# EAGLE design samd51breakout (EAGLE 7.7.0)
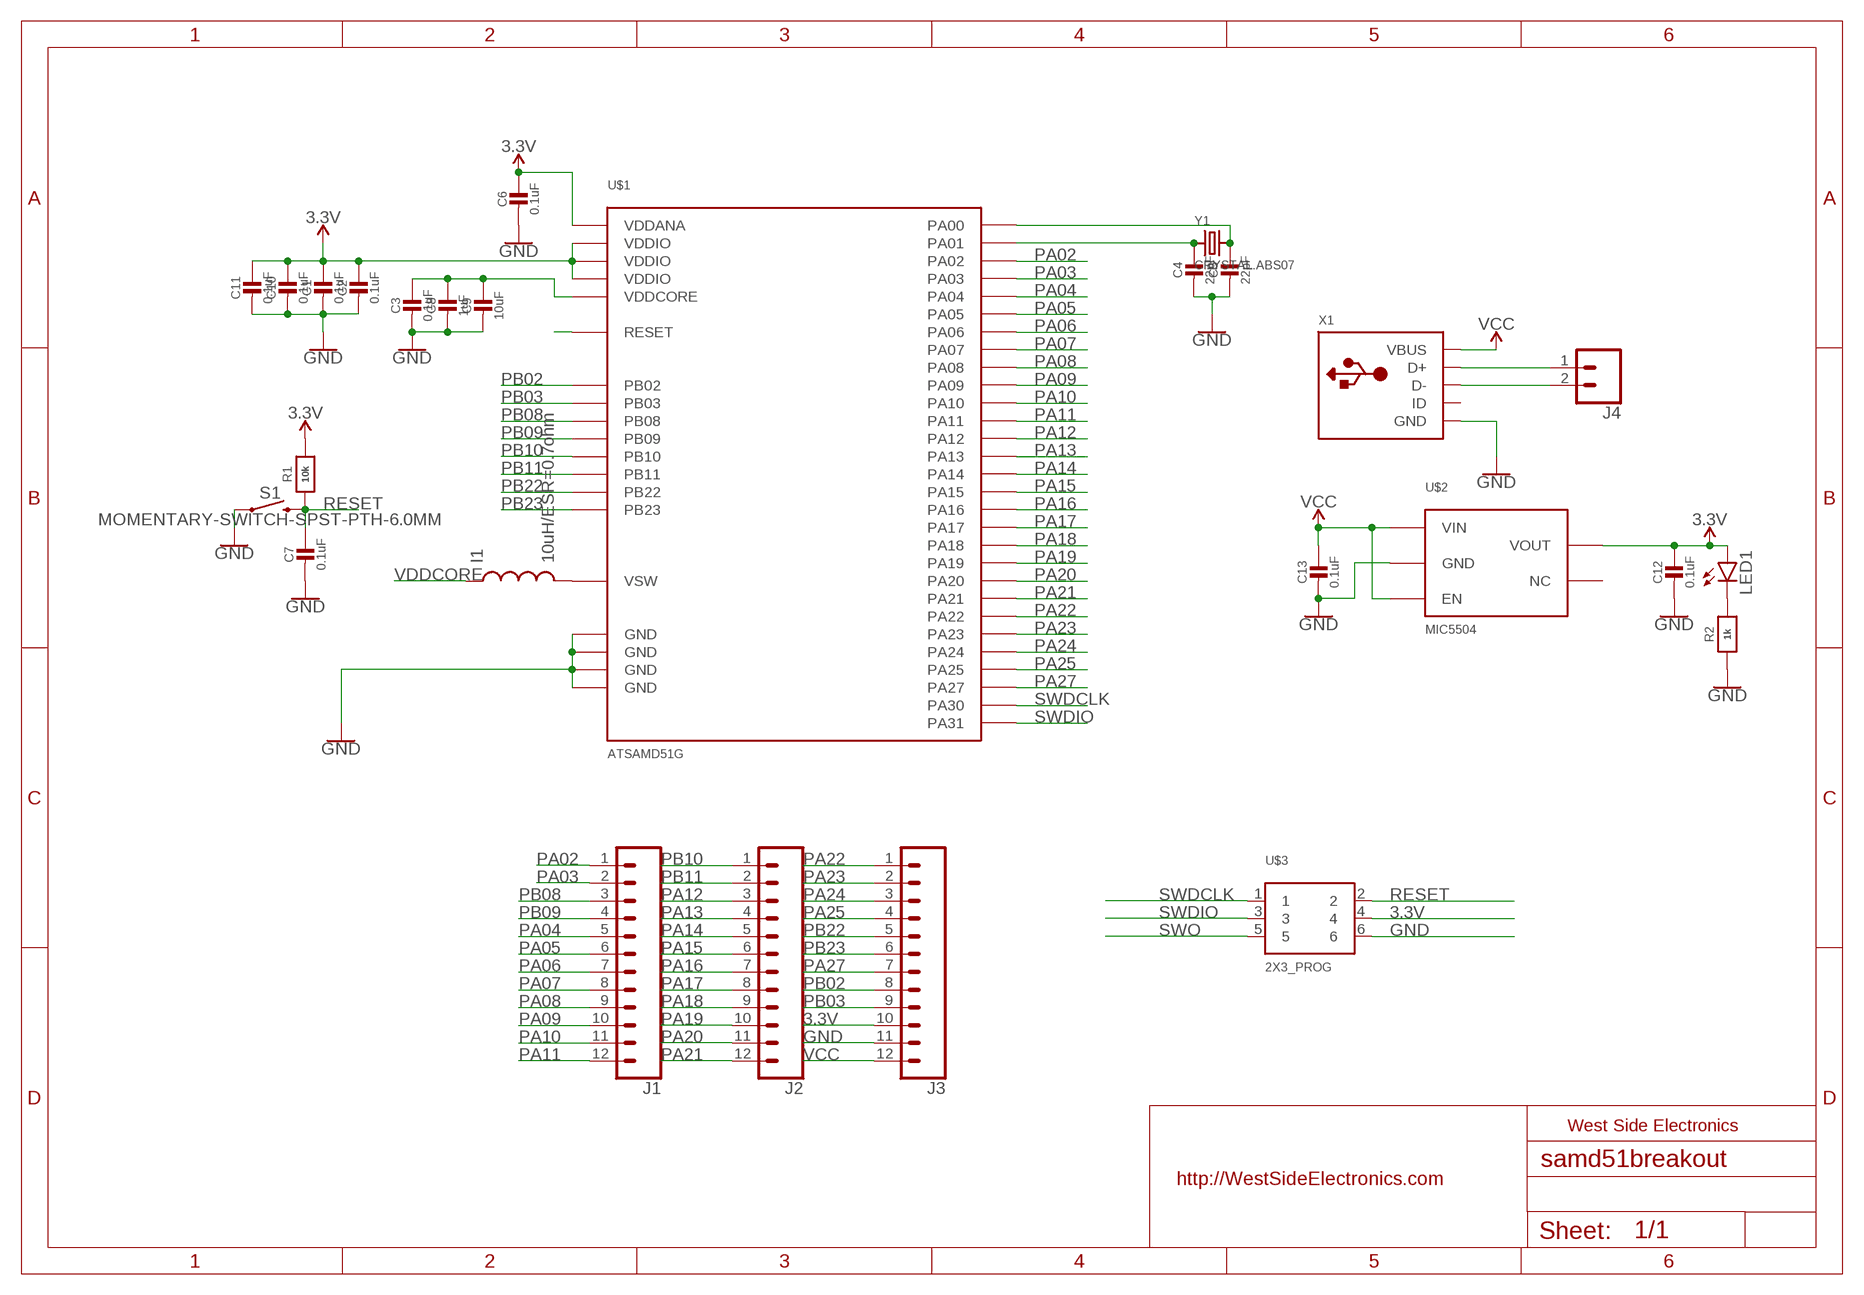
[diagram p0: schematic, sheet 1]

## Parts
C1  0.1uF  CAP_CERAMIC_0603MP  [_0603MP]
C2  0.1uF  CAP_CERAMIC_0603MP  [_0603MP]
C3  0.1uF  CAP_CERAMIC_0603MP  [_0603MP]
C4  22pF  CAP_CERAMIC_0603MP  [_0603MP]
C5  22pF  CAP_CERAMIC_0603MP  [_0603MP]
C6  0.1uF  CAP_CERAMIC_0603MP  [_0603MP]
C7  0.1uF  CAP_CERAMIC_0603MP  [_0603MP]
C8  1uF  CAP_CERAMIC_0603MP  [_0603MP]
C9  10uF  CAP_CERAMIC_0603MP  [_0603MP]
C10  0.1uF  CAP_CERAMIC_0603MP  [_0603MP]
C11  0.1uF  CAP_CERAMIC_0603MP  [_0603MP]
C12  0.1uF  CAP_CERAMIC_0603MP  [_0603MP]
C13  0.1uF  CAP_CERAMIC_0603MP  [_0603MP]
I1  10uH/ESR=0.7ohm  IND  [0805]
J1  CONN_12  [1X12]
J2  CONN_12  [1X12]
J3  CONN_12  [1X12]
J4  CONN_02  [1X02]
LED1  LED0603  [LED-0603]
R1  10k  RESISTOR_0603MP  [_0603MP]
R2  1k  RESISTOR_0603MP  [_0603MP]
S1  MOMENTARY-SWITCH-SPST-PTH-6.0MM  [TACTILE_SWITCH_PTH_6.0MM]
U$1  ATSAMD51G  [QFN-48]
U$2  MIC5504  [SOT23-5]
U$3  2X3_PROG  [2X3-SMD_PROG]
X1  MICROBUILDER_USB_MICRO_20329_V2  [MICROBUILDER_4UCONN_20329_V2]
Y1  CRYSTAL.ABS07  [ABS07]

## Nets
3.3V: C1.1 C2.1 C6.1 C10.1 C11.1 C12.1 J3.10 LED1.A R1.2 U$1.6(VDDANA) U$1.17(VDDIO) U$1.36(VDDIO) U$1.44(VDDIO) U$2.5(VOUT) U$3.4
GND: C1.2 C2.2 C3.2 C4.2 C5.2 C6.2 C7.2 C8.2 C9.2 C10.2 C11.2 C12.2 C13.2 J3.11 R2.1 S1.1 U$1.5(GND) U$1.18(GND) U$1.35(GND) U$1.42(GND) U$2.2(GND) U$3.6 X1.BASE@1(GND) X1.BASE@2(GND) X1.GND X1.SPRT@1(GND) X1.SPRT@2(GND) X1.SPRT@3(GND) X1.SPRT@4(GND)
N$1: I1.2 U$1.43(VSW)
N$2: LED1.C R2.2
N$4: C4.1 U$1.2(PA01) Y1.1
N$5: C5.1 U$1.1(PA00) Y1.2
N$7: J4.1 X1.D+
N$8: J4.2 X1.D-
PA02: J1.1 U$1.3(PA02)
PA03: J1.2 U$1.4(PA03)
PA04: J1.5 U$1.9(PA04)
PA05: J1.6 U$1.10(PA05)
PA06: J1.7 U$1.11(PA06)
PA07: J1.8 U$1.12(PA07)
PA08: J1.9 U$1.13(PA08)
PA09: J1.10 U$1.14(PA09)
PA10: J1.11 U$1.15(PA10)
PA11: J1.12 U$1.16(PA11)
PA12: J2.3 U$1.21(PA12)
PA13: J2.4 U$1.22(PA13)
PA14: J2.5 U$1.23(PA14)
PA15: J2.6 U$1.24(PA15)
PA16: J2.7 U$1.25(PA16)
PA17: J2.8 U$1.26(PA17)
PA18: J2.9 U$1.27(PA18)
PA19: J2.10 U$1.28(PA19)
PA20: J2.11 U$1.29(PA20)
PA21: J2.12 U$1.30(PA21)
PA22: J3.1 U$1.31(PA22)
PA23: J3.2 U$1.32(PA23)
PA24: J3.3 U$1.33(PA24)
PA25: J3.4 U$1.34(PA25)
PA27: J3.7 U$1.39(PA27)
PB02: J3.8 U$1.47(PB02)
PB03: J3.9 U$1.48(PB03)
PB08: J1.3 U$1.7(PB08)
PB09: J1.4 U$1.8(PB09)
PB10: J2.1 U$1.19(PB10)
PB11: J2.2 U$1.20(PB11)
PB22: J3.5 U$1.37(PB22)
PB23: J3.6 U$1.38(PB23)
RESET: C7.1 R1.1 S1.3 U$1.40(RESET) U$3.2
SWDCLK: U$1.45(PA30) U$3.1
SWDIO: U$1.46(PA31) U$3.3
SWO: U$3.5
VCC: C13.1 J3.12 U$2.1(VIN) U$2.3(EN) X1.VBUS
VDDCORE: C3.1 C8.1 C9.1 I1.1 U$1.41(VDDCORE)
Unconnected: U$2.4(NC) X1.ID

## Library data of the parts
C1-C13 = microbuilder:CAP_CERAMIC: Ceramic Capacitors For new designs, use the packages preceded by an '_' character since they are more reliable: The following footprints should be used on most boards: _0402 - Standard footprint for regular board layouts _0603 - Standard footprint for regular board layouts _0805 - Standard footprint for regular board layouts _1206 - Standard footprint for regular board layouts For extremely tight-pitch boards where space is at a premium, the following 'micro-pitch' footprints can be used (smaller pads, no silkscreen outline, etc.): _0402MP - Micro-pitch footprint for very dense/compact boards _0603MP - Micro-pitch footprint for very dense/compact boards _0805MP - Micro-pitch footprint for very dense/compact boards _1206MP - Micro-pitch footprint for very dense/compact boards
I1 = Ilya_Teach:IND
J1-J3 = SparkFun-Connectors:CONN_12: Multi connection point. Often used as Generic Header-pin footprint for 0.1 inch spaced/style header connections On any of the 0.1 inch spaced packages, you can populate with these: Break Away Headers - Straight <https://www.sparkfun.com/products/116> (PRT-00116) Break Away Male Headers - Right Angle <https://www.sparkfun.com/products/553> (PRT-00553) Female Headers <https://www.sparkfun.com/products/115> (PRT-00115) Break Away Headers - Machine Pin <https://www.sparkfun.com/products/117> (PRT-00117) Break Away Female Headers - Swiss Machine Pin <https://www.sparkfun.com/products/743> (PRT-00743) For SCREWTERMINALS and SPRING TERMINALS visit here: Screw Terimnals on SparkFun.com <https://www.sparkfun.com/search/results?term=Screw+Terminals> (5mm/3.5mm/2.54mm spacing) This device is also useful as a general connection point to wire up your design to another part of your project. Our various solder wires solder well into these plated through hole pads. Hook-Up Wire - Assortment (Stranded, 22 AWG) <https://www.sparkfun.com/products/11375> (PRT-11375) Hook-Up Wire - Assortment (Solid Core, 22 AWG) <https://www.sparkfun.com/products/11367> (PRT-11367) View the entire wire category on our website here <https://www.sparkfun.com/categories/141> Special notes: Molex polarized connector foot print use with SKU : PRT-08231 with associated crimp pins and housings. 1MM SMD Version SKU: PRT-10208 NOTES ON THE VARIANTS LOCK and LOCK_LONGPADS... This footprint was designed to help hold the alignment of a through-hole component (i.e. 6-pin header) while soldering it into place. You may notice that each hole has been shifted either up or down by 0.005 of an inch from it's more standard position (which is a perfectly straight line). This slight alteration caused the pins (the squares in the middle) to touch the edges of the holes. Because they are alternating, it causes a "brace" to hold the component in place. 0.005 has proven to be the perfect amount of "off-center" position when using our standard breakaway headers. Although looks a little odd when you look at the bare footprint, once you have a header in there, the alteration is very hard to notice. Also,if you push a header all the way into place, it is covered up entirely on the bottom side.
J4 = SparkFun-Connectors:CONN_02: Multi connection point. Often used as Generic Header-pin footprint for 0.1 inch spaced/style header connections On any of the 0.1 inch spaced packages, you can populate with these: Break Away Headers - Straight <https://www.sparkfun.com/products/116> (PRT-00116) Break Away Male Headers - Right Angle <https://www.sparkfun.com/products/553> (PRT-00553) Female Headers <https://www.sparkfun.com/products/115> (PRT-00115) Break Away Headers - Machine Pin <https://www.sparkfun.com/products/117> (PRT-00117) Break Away Female Headers - Swiss Machine Pin <https://www.sparkfun.com/products/743> (PRT-00743) For SCREWTERMINALS and SPRING TERMINALS visit here: Screw Terimnals on SparkFun.com <https://www.sparkfun.com/search/results?term=Screw+Terminals> (5mm/3.5mm/2.54mm spacing) This device is also useful as a general connection point to wire up your design to another part of your project. Our various solder wires solder well into these plated through hole pads. Hook-Up Wire - Assortment (Stranded, 22 AWG) <https://www.sparkfun.com/products/11375> (PRT-11375) Hook-Up Wire - Assortment (Solid Core, 22 AWG) <https://www.sparkfun.com/products/11367> (PRT-11367) View the entire wire category on our website here <https://www.sparkfun.com/categories/141> Special notes: Molex polarized connector foot print use with: PRT-08233 with associated crimp pins and housings. 2.54_SCREWTERM for use with PRT-10571. 3.5mm Screw Terminal footprints for PRT-08084 5mm Screw Terminal footprints for use with PRT-08432
LED1 = genLib:LED: LEDs Standard schematic elements and footprints for 5mm, 3mm, 1206, and 0603 sized LEDs. 5mm - Spark Fun Electronics SKU : COM-00529 (and others)
R1 R2 = microbuilder:RESISTOR: Resistors For new designs, use the packages preceded by an '_' character since they are more reliable: The following footprints should be used on most boards: _0402 - Standard footprint for regular board layouts _0603 - Standard footprint for regular board layouts _0805 - Standard footprint for regular board layouts _1206 - Standard footprint for regular board layouts For extremely tight-pitch boards where space is at a premium, the following 'micro-pitch' footprints can be used (smaller pads, no silkscreen outline, etc.): _0402MP - Micro-pitch footprint for very dense/compact boards _0603MP - Micro-pitch footprint for very dense/compact boards _0805MP - Micro-pitch footprint for very dense/compact boards _1206MP - Micro-pitch footprint for very dense/compact boards
S1 = SparkFun-Switches:MOMENTARY-SWITCH-SPST: Momentary Switch (Pushbutton) - SPST Normally-open (NO) SPST momentary switches (buttons, pushbuttons). Variants PTH-12MM - 12mm square, through-hole Momentary Pushbutton Switch - 12mm Square <https://www.sparkfun.com/products/9190> (COM-09190) PTH-6.0MM, PTH-6.0MM-KIT - 6.0mm square, through-hole Mini Pushbutton Switch <https://www.sparkfun.com/products/97> (COM-00097) KIT package intended for soldering kit's - only one side of pads' copper is exposed. PTH-RIGHT-ANGLE-KIT - Right-angle, through-hole Right Angle Tactile Button <https://www.sparkfun.com/products/10791> - Used on SparkFun BigTime Watch Kit <https://www.sparkfun.com/products/11734> SMD-12MM - 12mm square, surface-mount Tactile Button - SMD (12mm) <https://www.sparkfun.com/products/12993> (COM-12993) Used on SparkFun PicoBoard <https://www.sparkfun.com/products/11888> SMD-4.5MM - 4.5mm Square Trackball Switch Used on SparkFun Blackberry Trackballer Breakout <https://www.sparkfun.com/products/13169> SMD-4.6MMX2.8MM - 4.60mm x 2.80mm, surface mount Used on SparkFun SAMD21 Mini Breakout <https://www.sparkfun.com/products/13664> SMD-5.2MM, SMD-5.2-REDUNDANT - 5.2mm square, surface-mount Mini Pushbutton Switch - SMD <https://www.sparkfun.com/products/8720> (COM-08720) Used on Arduino Pro Mini <https://www.sparkfun.com/products/11114> REDUNDANT package connects both switch circuits together SMD-6.0X3.5MM - 6.0 x 3.5mm, surface mount Momentary Reset Switch SMD <https://www.sparkfun.com/products/8229> (COM-08229) SMD-6.2MM-TALL - 6.2mm square, surface mount Tactile Button - SMD (6mm) <https://www.sparkfun.com/products/12992> Used on SparkFun Digital Sandbox <https://www.sparkfun.com/products/12651> SMD-RIGHT-ANGLE - Right-angle, surface mount Used on SparkFun Block for Intel® Edison - Arduino <https://www.sparkfun.com/products/13036>; PROD_ID: SWCH-08441; SF_SKU: COM-00097
U$1 = genLib:ATSAMD51G
U$2 = genLib:MIC5504
U$3 = Ilya_Teach:2X3_PROG
X1 = genLib:MICROBUILDER_USB: USB Connectors USBMINIB - Surface Mount Female Mini-B USB Connector 4UConnector: 06564
Y1 = genLib:CRYSTAL

## Board
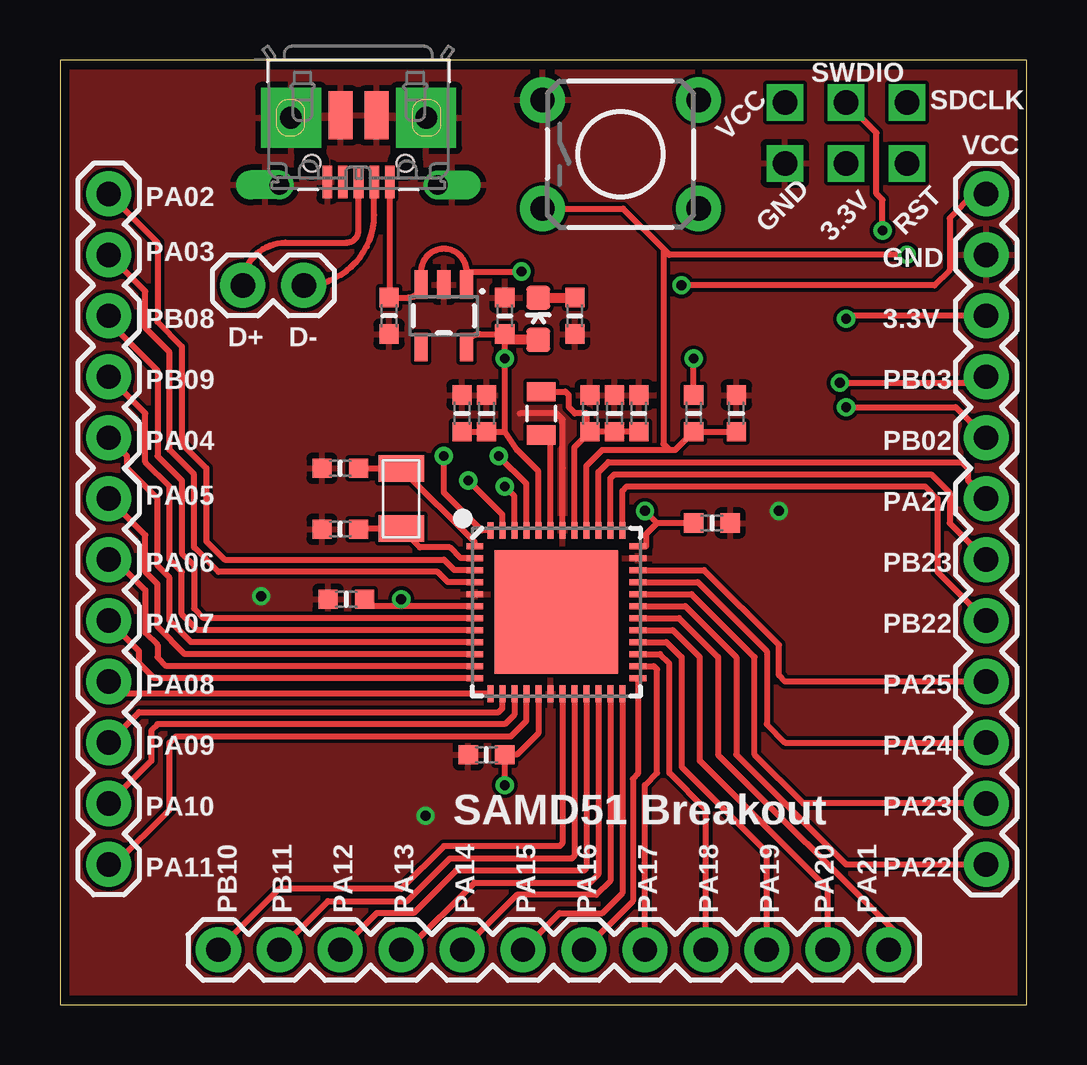
[diagram p1: board, top side]
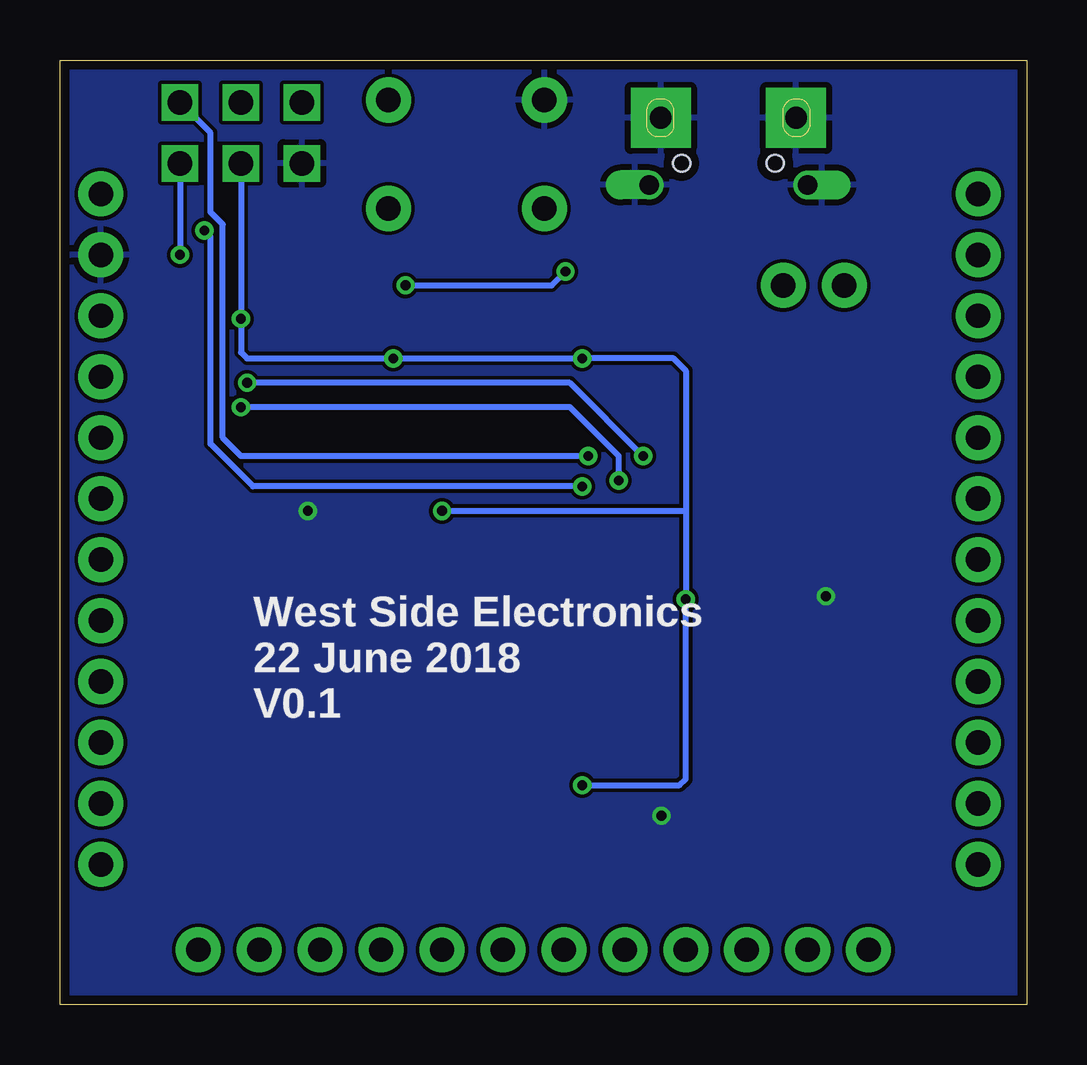
[diagram p2: board, bottom side, seen from below]

Size 40.31 x 39.36 mm. Coordinates in mm from the lower left corner, seen from the top.
Outline: 0,0 40.31,0 40.31,39.36 0,39.36 0,0
Copper layers (1*16): Top 0.0356mm / dielectric 1.5011mm / Bottom 0.0356mm
Design rules "LaenPCBOrder *": minimum track width 6mil, minimum drill 13mil, track to track 6mil, track to pad 6mil, pad to pad 6mil, via to via 6mil, smd to smd 6mil, copper to edge 15mil, drill to drill 6mil, minimum pad ring 7mil, minimum via ring 7mil, stop-mask expansion 3mil, vias tented up to drill 30mil, thermal gap 10mil

### Footprints (pad centres in the part's own frame; a part is rotated, then mirrored left to right if it is on the bottom)
_0603MP = smd 0.8 x 0.8: 1 -0.762,0; 2 0.762,0
0805 = smd 0.8 x 1.2: 1 -0.9,0; 2 0.9,0
1X12 = drill 1.016 pad 1.88: 1 0,0; 2 2.54,0; 3 5.08,0; 4 7.62,0; 5 10.16,0; 6 12.7,0; 7 15.24,0; 8 17.78,0; 9 20.32,0; 10 22.86,0; 11 25.4,0; 12 27.94,0
1X02 = drill 1.016 pad 1.88: 1 0,0; 2 2.54,0
LED-0603 = smd 1 x 1: A 0,-0.877; C 0,0.877
TACTILE_SWITCH_PTH_6.0MM = drill 1.016 pad 1.88: 1 -3.251,2.261; 2 3.251,2.261; 3 -3.251,-2.261; 4 3.251,-2.261
QFN-48 = smd 0.7 x 0.25: 1 -3.4,2.75; 2 -3.4,2.25; 3 -3.4,1.75; 4 -3.4,1.25; 5 -3.4,0.75; 6 -3.4,0.25; 7 -3.4,-0.25; 8 -3.4,-0.75; 9 -3.4,-1.25; 10 -3.4,-1.75; 11 -3.4,-2.25; 12 -3.4,-2.75; 25 3.4,-2.75; 26 3.4,-2.25; 27 3.4,-1.75; 28 3.4,-1.25; 29 3.4,-0.75; 30 3.4,-0.25; 31 3.4,0.25; 32 3.4,0.75; 33 3.4,1.25; 34 3.4,1.75; 35 3.4,2.25; 36 3.4,2.75 | smd 0.25 x 0.7: 13 -2.75,-3.4; 14 -2.25,-3.4; 15 -1.75,-3.4; 16 -1.25,-3.4; 17 -0.75,-3.4; 18 -0.25,-3.4; 19 0.25,-3.4; 20 0.75,-3.4; 21 1.25,-3.4; 22 1.75,-3.4; 23 2.25,-3.4; 24 2.75,-3.4; 37 2.75,3.4; 38 2.25,3.4; 39 1.75,3.4; 40 1.25,3.4; 41 0.75,3.4; 42 0.25,3.4; 43 -0.25,3.4; 44 -0.75,3.4; 45 -1.25,3.4; 46 -1.75,3.4; 47 -2.25,3.4; 48 -2.75,3.4 | smd 5.15 x 5.15: EP 0,0
SOT23-5 = smd 0.55 x 1.2: 1 -0.95,-1.3; 2 0,-1.3; 3 0.95,-1.3; 4 0.95,1.3; 5 -0.95,1.3
2X3-SMD_PROG = drill 1.016 pad 1.27 square: 1 -1.27,-1.27; 2 -1.27,1.27; 3 1.27,-1.27; 4 1.27,1.27; 5 3.81,-1.27; 6 3.81,1.27
MICROBUILDER_4UCONN_20329_V2 = smd 1 x 2: BASE@1 -0.75,-2; BASE@2 0.75,-2 | smd 0.4 x 1.35: D+ 0,0.775; D- -0.65,0.775; GND 1.3,0.775; ID 0.65,0.775; VBUS -1.3,0.775 | drill 0.8 pad 1.2 offset: SPRT@1 -3.3,0.9; SPRT@2 3.3,0.9 | drill 0.9 pad 2.5 square: SPRT@3 -2.819,-1.9; SPRT@4 2.819,-1.9 | hole 0.7: -1.95,0; 1.95,0
ABS07 = smd 1.1 x 1.9: 1 -1.25,0; 2 1.25,0

### Placement (x,y rotation side)
C1  17.78,24.64 90 top
C2  27.18,20.07 0 top
C3  24.13,24.64 90 top
C4  11.68,19.81 180 top
C5  11.68,22.35 180 top
C6  11.94,16.89 180 top
C7  28.19,24.64 90 top
C8  22.1,24.64 90 top
C9  23.11,24.64 90 top
C10  16.76,24.64 90 top
C11  17.78,10.41 180 top
C12  18.54,28.7 90 top
C13  13.72,28.7 270 top
I1  20.07,24.64 270 top
J1  2.03,33.78 270 top
J2  6.6,2.29 0 top
J3  38.61,5.84 90 top
J4  7.62,29.97 0 top
LED1  19.94,28.58 0 top
R1  26.42,24.64 90 top
R2  21.46,28.7 90 top
S1  23.37,35.43 0 top
U$1  20.69,16.36 0 top
U$2  16,28.7 180 top
U$3  34.04,36.32 180 top
X1  12.45,35.05 180 top
Y1  14.22,21.08 90 top

### Tracks (layer width: path | path; a pad name or v marks a point on that pad's centre or on a via)
3.3V  (via drill 0.41)
  Top 0.254: U$2.5 arc-90 17.49,27.94 C12.1 v18.54,26.92 18.54,23.88 | C10.1 C1.1 18.54,23.88 | U$1.44 19.94,22.22 19.05,23.11 18.54,23.88 | R1.2 v26.42,26.92 | U$1.6 13.97,16.61 | 13.97,16.61 13.11,16.61 C6.1 | U$1.17 19.94,11.31 19.05,10.41 C11.1 v18.54,9.14 | U$1.36 24.44,19.11 24.44,19.61 24.89,20.07 | v14.22,16.89 14.13,16.89 13.97,16.61 | J3.10 32.89,28.7 v32.77,28.58 | C2.1 24.89,20.07 | 24.89,20.07 v24.38,20.57
  Top 0.406: LED1.A 18.54,27.7 C12.1
  Bottom 0.254: U$3.4 v32.77,28.58 32.77,27.18 32.51,26.92 v26.42,26.92 v18.54,26.92 14.73,26.92 14.22,26.42 14.22,20.57 | v24.38,20.57 14.22,20.57 | 14.22,20.57 v14.22,16.89 14.22,9.4 14.48,9.14 v18.54,9.14
GND  (via drill 0.41)
  Top 0.254: U$1.42 20.96,22.35 20.96,24.38 20.7,24.64 19.18,24.64
  other vias: 29.97,20.57 8.38,17.02 15.24,7.87
  pour Top: -3.05,44.7 46.48,44.7 46.48,-9.14 -3.05,-9.14
  pour Bottom: -3.05,44.7 46.48,44.7 46.48,-9.14 -3.05,-9.14
N$1
  Top 0.254: U$1.43 20.44,23.62 I1.2
N$2
  Top 0.406: LED1.C R2.2
N$4
  Top 0.254: U$1.2 16.7,18.61 16.26,19.05 15.01,19.05 Y1.1 12.47,19.83 C4.1
N$5
  Top 0.254: U$1.1 17.29,19.26 Y1.2 12.47,22.33 C5.1
N$7
  Top 0.254: J4.1 arc-90 9.4,31.75 11.94,31.75 arc90 12.45,32.26 X1.D+
N$8
  Top 0.254: J4.2 arc90 13.1,32.91 X1.D-
PA02
  Top 0.254: J1.1 4.06,31.75 4.06,28.45 5.08,27.43 5.08,23.37 6.1,22.35 6.1,19.3 6.86,18.54 16,18.54 16.44,18.11 U$1.3
PA03
  Top 0.254: U$1.4 16.18,17.61 15.75,18.03 6.6,18.03 5.59,19.05 5.59,22.1 4.57,23.11 4.57,27.18 3.56,28.19 3.56,29.72 J1.2
PA04
  Top 0.254: U$1.9 5.47,15.11 4.57,16 4.57,17.78 4.06,18.29 4.06,21.08 2.79,22.35 2.79,22.86 J1.5
PA05
  Top 0.254: U$1.10 5.21,14.61 4.06,15.75 4.06,17.53 3.56,18.03 3.56,19.56 J1.6
PA06
  Top 0.254: J1.7 2.29,18.54 3.56,17.27 3.56,15.49 4.06,14.99 4.06,14.48 4.44,14.11 U$1.11
PA07
  Top 0.254: U$1.12 3.92,13.61 3.3,14.22 3.3,14.73 J1.8
PA08
  Top 0.254: U$1.13 2.54,12.96 J1.9
PA09
  Top 0.254: J1.10 3.3,12.19 18.29,12.19 18.44,12.35 U$1.14
PA10
  Top 0.254: U$1.15 18.94,12.08 18.54,11.68 4.06,11.68 3.81,11.43 3.81,10.16 J1.11
PA11
  Top 0.254: J1.12 2.29,5.84 4.57,8.13 4.57,10.92 4.83,11.18 18.8,11.18 19.44,11.82 U$1.16
PA12
  Top 0.254: U$1.21 21.94,5.69 21.84,5.59 16.51,5.59 14.73,3.81 13.21,3.81 J2.3
PA13
  Top 0.254: J2.4 14.48,2.29 17.27,5.08 22.1,5.08 22.44,5.42 U$1.22
PA14
  Top 0.254: U$1.23 22.94,5.16 22.35,4.57 19.05,4.57 J2.5
PA15
  Top 0.254: J2.6 20.83,3.81 22.61,3.81 23.44,4.65 U$1.24
PA16
  Top 0.254: U$1.25 24.09,9.61 23.88,9.4 23.88,4.32 J2.7
PA17
  Top 0.254: J2.8 24.38,9.14 24.89,9.65 24.89,13.97 24.76,14.11 U$1.26
PA18
  Top 0.254: J2.9 26.92,8.13 25.4,9.65 25.4,14.22 25.02,14.61 U$1.27
PA19
  Top 0.254: J2.10 29.46,6.35 25.91,9.91 25.91,14.48 25.28,15.11 U$1.28
PA20
  Top 0.254: J2.11 32,4.83 26.67,10.16 26.67,14.48 25.54,15.61 U$1.29
PA21
  Top 0.254: U$1.30 25.8,16.11 27.43,14.48 27.43,10.41 34.8,3.05 34.8,2.54 J2.12
PA22
  Top 0.254: U$1.31 26.07,16.61 28.19,14.48 28.19,10.41 32.77,5.84 J3.1
PA23
  Top 0.254: J3.2 30.99,8.38 28.96,10.41 28.96,14.48 26.33,17.11 U$1.32
PA24
  Top 0.254: U$1.33 26.59,17.61 29.46,14.73 29.46,11.68 30.23,10.92 J3.3
PA25
  Top 0.254: J3.4 30.23,13.46 29.97,13.72 29.97,14.99 26.85,18.11 U$1.34
PA27
  Top 0.254: U$1.39 22.44,22.19 22.86,22.61 37.59,22.61 37.85,22.35 37.85,21.84 J3.7
PB02  (via drill 0.41)
  Top 0.254: U$1.47 18.44,20.42 v17.02,21.84 | v32.77,24.89 37.34,24.89 J3.8
  Bottom 0.254: v17.02,21.84 17.02,22.86 19.05,24.89 v32.77,24.89
PB03  (via drill 0.41)
  Top 0.254: U$1.48 17.58,19.76 16,21.34 v16,22.86 | v32.51,25.91 38.35,25.91 J3.9
  Bottom 0.254: v16,22.86 19.05,25.91 v32.51,25.91
PB08
  Top 0.254: J1.3 2.03,28.45 4.06,26.42 4.06,22.86 5.08,21.84 5.08,18.8 5.59,18.29 5.59,16.51 5.99,16.11 U$1.7
PB09
  Top 0.254: U$1.8 5.73,15.61 5.08,16.26 5.08,18.03 4.57,18.54 4.57,21.59 3.56,22.61 3.56,24.64 J1.4
PB10
  Top 0.254: U$1.19 20.94,6.72 20.83,6.6 16,6.6 14.22,4.83 9.14,4.83 J2.1
PB11
  Top 0.254: J2.2 11.18,4.32 14.48,4.32 16.26,6.1 21.34,6.1 21.44,6.2 U$1.20
PB22
  Top 0.254: U$1.37 23.44,21.41 23.62,21.59 36.07,21.59 36.58,21.08 36.58,18.03 J3.5
PB23
  Top 0.254: U$1.38 22.94,21.93 23.11,22.1 36.32,22.1 37.08,21.34 37.08,20.07 J3.6
RESET  (via drill 0.41)
  Top 0.254: U$1.40 21.94,22.45 22.61,23.11 25.4,23.11 | 25.4,23.11 25.65,23.11 R1.1 C7.1 | 25.15,31.5 25.15,23.37 25.4,23.11 | v35.31,31.24 25.4,31.24 25.21,31.43 25.15,31.5 | S1.3 23.47,33.17 25.15,31.5
  Bottom 0.254: U$3.2 v35.31,31.24
SWDCLK  (via drill 0.41)
  Top 0.254: U$1.45 19.44,21.71 v18.29,22.86
  Bottom 0.254: v18.29,22.86 32.77,22.86 33.53,23.62 33.53,32.51 34.04,33.02 34.04,36.32 U$3.1
SWDIO  (via drill 0.41)
  Top 0.254: U$1.46 18.94,21.19 v18.54,21.59 | v34.29,32.26 34.29,33.53 34.04,33.78 34.04,36.32 U$3.3
  Bottom 0.254: v18.54,21.59 32.26,21.59 34.04,23.37 34.04,32 v34.29,32.26
VCC  (via drill 0.41)
  Top 0.254: X1.VBUS 13.75,29.49 arc-90 C13.1 14.51,29.46 arc90 U$2.3 15.05,30.55 arc-90 16,31.5 arc-90 16.95,30.55 | U$2.1 16.95,30.55 | J3.12 38.1,33.78 37.08,32.77 37.08,30.61 36.45,29.97 v25.91,29.97 | 16.95,30.55 v19.24,30.55 v19.24,30.54
  Bottom 0.254: v25.91,29.97 19.81,29.97 v19.24,30.54
VDDCORE
  Top 0.254: U$1.41 21.44,23.22 C8.1 | C8.1 C9.1 C3.1 | I1.1 21.07,25.54 21.21,25.4 21.21,24.89 21.46,24.64 21.97,24.64 21.97,24 C8.1

### Text on the board
tPlace: VCC | SWDIO | SDCLK | VCC | PA02 | GND | 3.3V | RST | PA03 | GND | PB08 | 3.3V | D+ | D- | PB09 | PB03 | PA04 | PB02 | PA05 | PA27 | PA06 | PB23 | PA07 | PB22 | PA08 | PA25 | PA09 | PA24 | PA10 | PA23 | SAMD51 Breakout | PA11 | PA22 | PB10 | PB11 | PA12 | PA13 | PA14 | PA15 | PA16 | PA17 | PA18 | PA19 | PA20 | PA21
bPlace: West Side Electronics / 22 June 2018 / V0.1